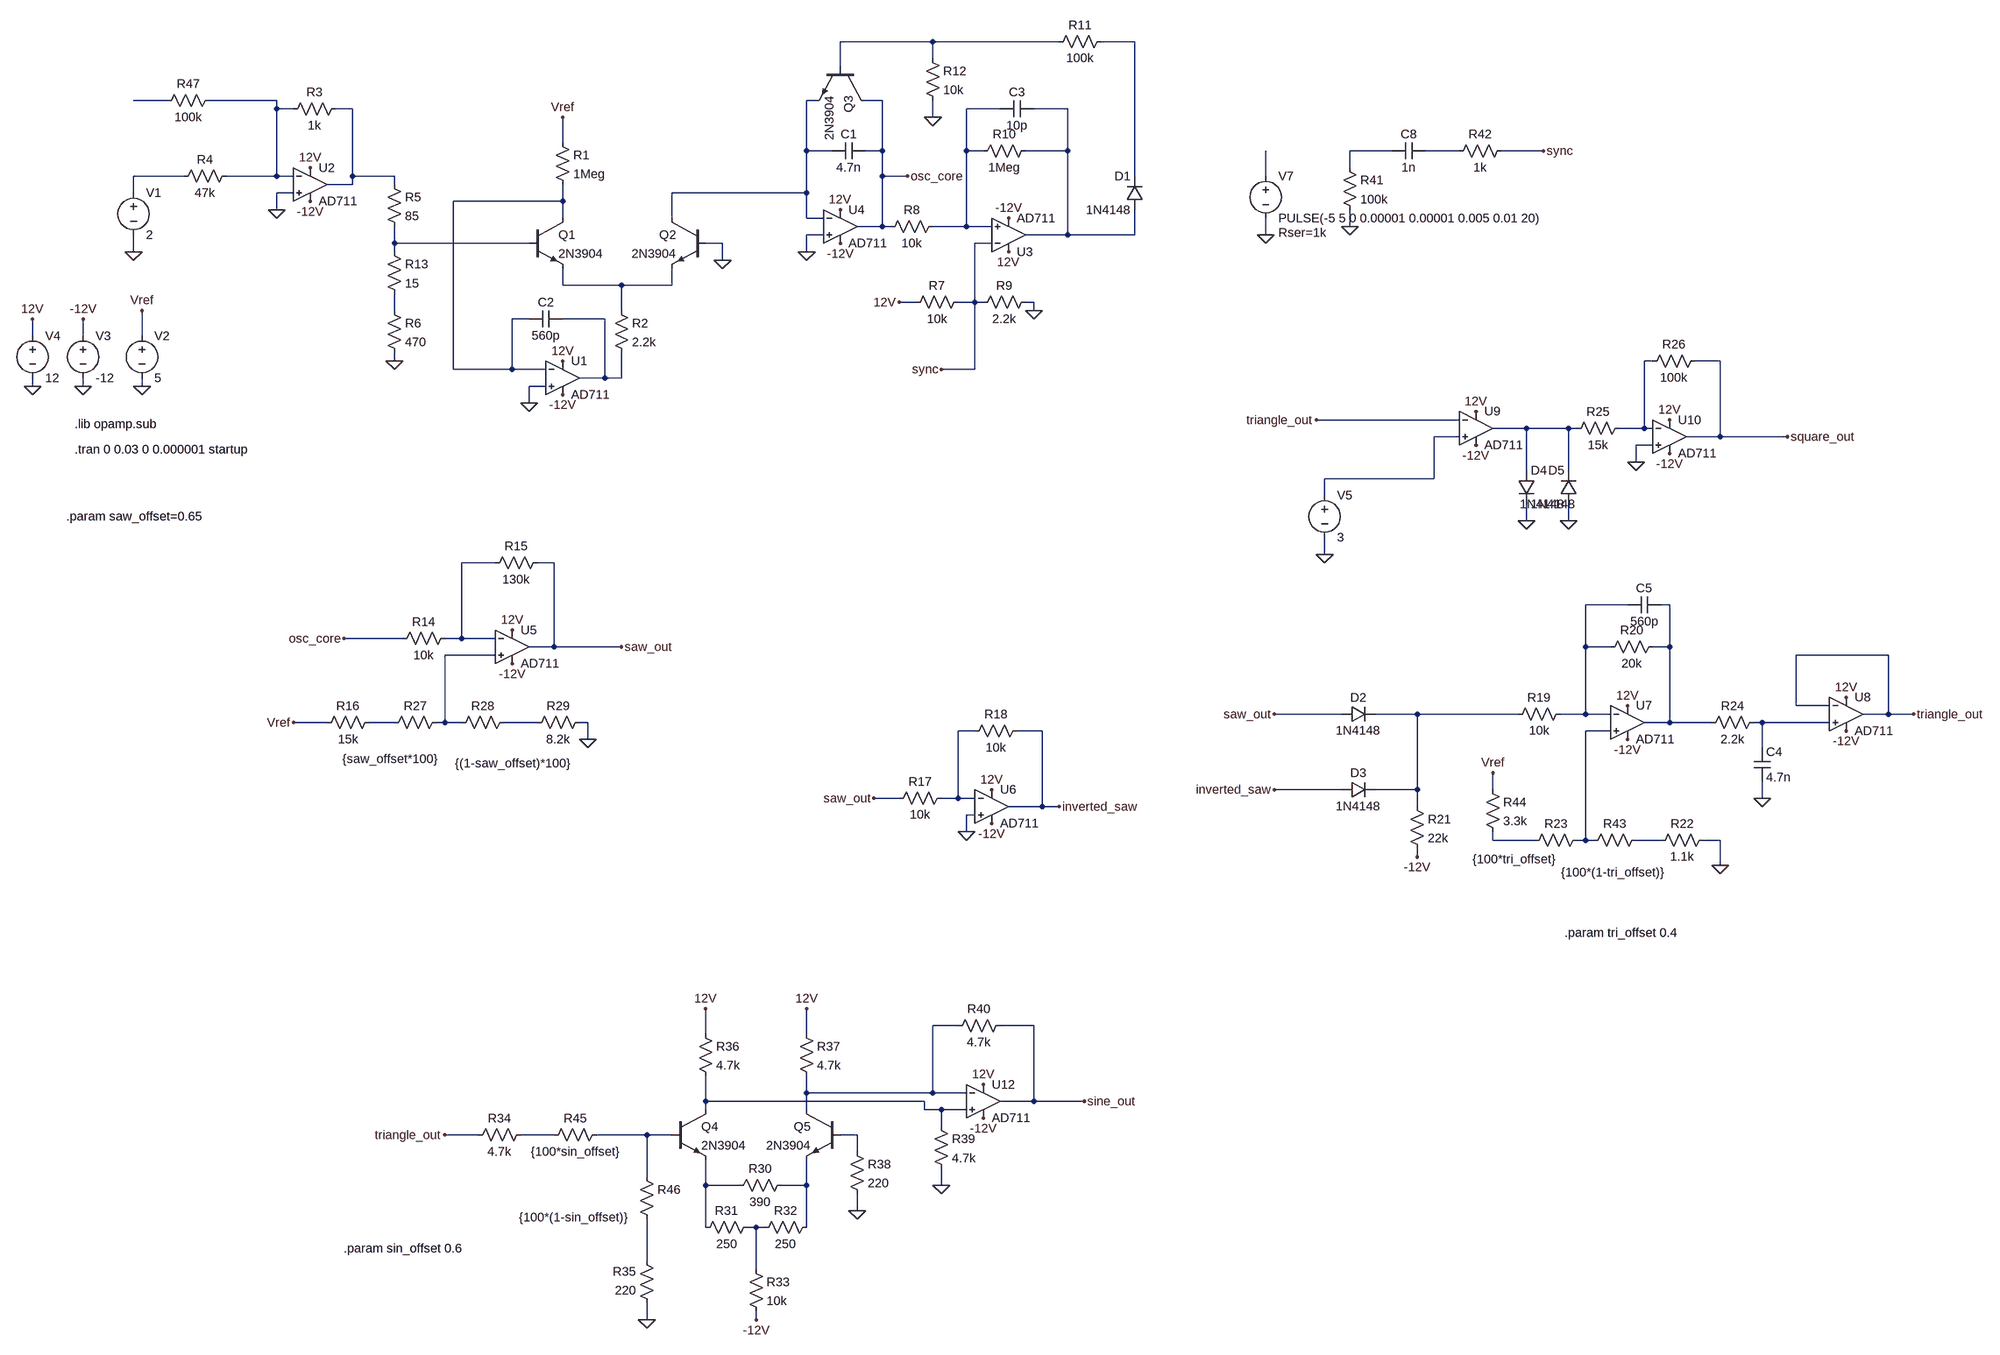
[diagram p0: schematic mfos.asc]
mfos.asc, the LTspice schematic file:
Version 4.1
SHEET 1 3204 2404
WIRE 896 -224 720 -224
WIRE 1136 -224 896 -224
WIRE 1280 -224 1216 -224
WIRE 896 -192 896 -224
WIRE 720 -176 720 -224
WIRE -560 -112 -624 -112
WIRE -352 -112 -480 -112
WIRE 672 -112 656 -112
WIRE 800 -112 768 -112
WIRE -352 -96 -352 -112
WIRE -320 -96 -352 -96
WIRE -208 -96 -240 -96
WIRE 1024 -96 960 -96
WIRE 1152 -96 1088 -96
WIRE 896 -80 896 -112
WIRE 192 -32 192 -80
WIRE 656 -16 656 -112
WIRE 704 -16 656 -16
WIRE 800 -16 800 -112
WIRE 800 -16 768 -16
WIRE 960 -16 960 -96
WIRE 992 -16 960 -16
WIRE 1152 -16 1152 -96
WIRE 1152 -16 1072 -16
WIRE 1824 -16 1744 -16
WIRE 1952 -16 1888 -16
WIRE 2112 -16 2032 -16
WIRE 1744 16 1744 -16
WIRE -528 32 -624 32
WIRE -352 32 -352 -96
WIRE -352 32 -448 32
WIRE -320 32 -352 32
WIRE -208 32 -208 -96
WIRE -128 32 -208 32
WIRE 800 32 800 -16
WIRE 848 32 800 32
WIRE 1280 32 1280 -224
WIRE 1584 32 1584 -16
WIRE -208 48 -208 32
WIRE -208 48 -256 48
WIRE -128 48 -128 32
WIRE -624 64 -624 32
WIRE -320 64 -352 64
WIRE 656 64 656 -16
WIRE 656 64 400 64
WIRE 192 80 192 48
WIRE 192 80 -16 80
WIRE -352 96 -352 64
WIRE 192 112 192 80
WIRE 400 112 400 64
WIRE 656 112 656 64
WIRE 688 112 656 112
WIRE 800 128 800 32
WIRE 800 128 752 128
WIRE 816 128 800 128
WIRE 960 128 960 -16
WIRE 960 128 896 128
WIRE 1008 128 960 128
WIRE 1744 128 1744 96
WIRE 688 144 656 144
WIRE 1152 144 1152 -16
WIRE 1152 144 1072 144
WIRE 1280 144 1280 96
WIRE 1280 144 1152 144
WIRE 1584 144 1584 112
WIRE -128 160 -128 128
WIRE 128 160 -128 160
WIRE 496 160 464 160
WIRE 1008 160 976 160
WIRE -624 176 -624 144
WIRE -128 176 -128 160
WIRE 656 176 656 144
WIRE 496 192 496 160
WIRE 192 240 192 208
WIRE 304 240 192 240
WIRE 400 240 400 208
WIRE 400 240 304 240
WIRE 864 272 832 272
WIRE 976 272 976 160
WIRE 976 272 944 272
WIRE 992 272 976 272
WIRE 1088 272 1072 272
WIRE -128 288 -128 256
WIRE 304 288 304 240
WIRE 1088 288 1088 272
WIRE 128 304 96 304
WIRE 272 304 192 304
WIRE -816 336 -816 304
WIRE -720 336 -720 304
WIRE -608 336 -608 288
WIRE -128 384 -128 368
WIRE 2320 384 2304 384
WIRE 2448 384 2400 384
WIRE -16 400 -16 80
WIRE 96 400 96 304
WIRE 96 400 -16 400
WIRE 160 400 96 400
WIRE 976 400 976 272
WIRE 976 400 912 400
WIRE 272 416 272 304
WIRE 272 416 224 416
WIRE 304 416 304 368
WIRE 304 416 272 416
WIRE -816 432 -816 416
WIRE -720 432 -720 416
WIRE -608 432 -608 416
WIRE 160 432 128 432
WIRE 128 464 128 432
WIRE 1952 496 1680 496
WIRE 2080 512 2016 512
WIRE 2160 512 2080 512
WIRE 2176 512 2160 512
WIRE 2304 512 2304 384
WIRE 2304 512 2256 512
WIRE 2320 512 2304 512
WIRE 1952 528 1904 528
WIRE 2448 528 2448 384
WIRE 2448 528 2384 528
WIRE 2576 528 2448 528
WIRE 2320 544 2288 544
WIRE 2288 576 2288 544
WIRE 2080 592 2080 512
WIRE 2160 592 2160 512
WIRE 1904 608 1904 528
WIRE 1904 608 1696 608
WIRE 1696 640 1696 608
WIRE 2080 688 2080 656
WIRE 2160 688 2160 656
WIRE 1696 752 1696 720
WIRE 64 768 0 768
WIRE 176 768 144 768
WIRE 2272 848 2192 848
WIRE 2352 848 2336 848
WIRE -112 912 -224 912
WIRE 0 912 0 768
WIRE 0 912 -32 912
WIRE 64 912 0 912
WIRE 176 928 176 768
WIRE 176 928 128 928
WIRE 304 928 176 928
WIRE 2192 928 2192 848
WIRE 2240 928 2192 928
WIRE 2352 928 2352 848
WIRE 2352 928 2320 928
WIRE 64 944 -32 944
WIRE 2768 944 2592 944
WIRE 2592 1040 2592 944
WIRE 2656 1040 2592 1040
WIRE 1728 1056 1600 1056
WIRE 1872 1056 1792 1056
WIRE 2064 1056 1872 1056
WIRE 2192 1056 2192 928
WIRE 2192 1056 2144 1056
WIRE 2240 1056 2192 1056
WIRE 2768 1056 2768 944
WIRE 2768 1056 2720 1056
WIRE 2816 1056 2768 1056
WIRE -256 1072 -320 1072
WIRE -128 1072 -176 1072
WIRE -32 1072 -32 944
WIRE -32 1072 -48 1072
WIRE 0 1072 -32 1072
WIRE 144 1072 80 1072
WIRE 240 1072 224 1072
WIRE 2352 1072 2352 928
WIRE 2352 1072 2304 1072
WIRE 2432 1072 2352 1072
WIRE 2528 1072 2512 1072
WIRE 2656 1072 2528 1072
WIRE 976 1088 944 1088
WIRE 1104 1088 1056 1088
WIRE 2240 1088 2192 1088
WIRE 240 1104 240 1072
WIRE 2528 1120 2528 1072
WIRE 1728 1200 1600 1200
WIRE 1872 1200 1872 1056
WIRE 1872 1200 1792 1200
WIRE 2016 1200 2016 1168
WIRE 832 1216 784 1216
WIRE 944 1216 944 1088
WIRE 944 1216 912 1216
WIRE 976 1216 944 1216
WIRE 2528 1216 2528 1184
WIRE 1104 1232 1104 1088
WIRE 1104 1232 1040 1232
WIRE 1136 1232 1104 1232
WIRE 1872 1232 1872 1200
WIRE 976 1248 960 1248
WIRE 960 1280 960 1248
WIRE 2016 1296 2016 1280
WIRE 2096 1296 2016 1296
WIRE 2192 1296 2192 1088
WIRE 2192 1296 2176 1296
WIRE 2208 1296 2192 1296
WIRE 2336 1296 2288 1296
WIRE 2448 1296 2416 1296
WIRE 1872 1328 1872 1312
WIRE 2448 1344 2448 1296
WIRE 944 1744 896 1744
WIRE 1088 1744 1024 1744
WIRE 464 1760 464 1712
WIRE 656 1760 656 1712
WIRE 656 1872 656 1840
WIRE 896 1872 896 1744
WIRE 896 1872 656 1872
WIRE 960 1872 896 1872
WIRE 464 1888 464 1840
WIRE 880 1888 464 1888
WIRE 1088 1888 1088 1744
WIRE 1088 1888 1024 1888
WIRE 1184 1888 1088 1888
WIRE 464 1904 464 1888
WIRE 656 1904 656 1872
WIRE 880 1904 880 1888
WIRE 912 1904 880 1904
WIRE 960 1904 912 1904
WIRE 912 1936 912 1904
WIRE 32 1952 -32 1952
WIRE 176 1952 112 1952
WIRE 352 1952 256 1952
WIRE 400 1952 352 1952
WIRE 752 1952 720 1952
WIRE 752 1984 752 1952
WIRE 352 2032 352 1952
WIRE 464 2048 464 2000
WIRE 528 2048 464 2048
WIRE 656 2048 656 2000
WIRE 656 2048 608 2048
WIRE 912 2048 912 2016
WIRE 752 2096 752 2064
WIRE 464 2128 464 2048
WIRE 560 2128 544 2128
WIRE 576 2128 560 2128
WIRE 656 2128 656 2048
WIRE 352 2192 352 2112
WIRE 560 2208 560 2128
WIRE 352 2304 352 2272
WIRE 560 2304 560 2288
FLAG 496 192 0
FLAG -608 432 0
FLAG -608 288 Vref
FLAG 192 -80 Vref
FLAG -816 432 0
FLAG -720 432 0
FLAG -816 304 12V
FLAG -720 304 -12V
FLAG 192 448 -12V
FLAG 192 384 12V
FLAG 128 464 0
FLAG -288 80 -12V
FLAG -288 16 12V
FLAG -352 96 0
FLAG -128 384 0
FLAG 656 176 0
FLAG 1088 288 0
FLAG 832 272 12V
FLAG 720 160 -12V
FLAG 720 96 12V
FLAG 896 -80 0
FLAG 1040 112 -12V
FLAG 1040 176 12V
FLAG 848 32 osc_core
FLAG -224 912 osc_core
FLAG 96 960 -12V
FLAG 96 896 12V
FLAG 304 928 saw_out
FLAG 1008 1264 -12V
FLAG 1008 1200 12V
FLAG 960 1280 0
FLAG 784 1216 saw_out
FLAG 1136 1232 inverted_saw
FLAG 1600 1056 saw_out
FLAG 1600 1200 inverted_saw
FLAG 2272 1104 -12V
FLAG 2272 1040 12V
FLAG 1872 1328 -12V
FLAG 2688 1088 -12V
FLAG 2688 1024 12V
FLAG 2816 1056 triangle_out
FLAG 1984 544 -12V
FLAG 1984 480 12V
FLAG 1696 752 0
FLAG 1680 496 triangle_out
FLAG 2352 560 -12V
FLAG 2352 496 12V
FLAG 2288 576 0
FLAG 2080 688 0
FLAG 2160 688 0
FLAG 2576 528 square_out
FLAG 352 2304 0
FLAG 464 1712 12V
FLAG 656 1712 12V
FLAG 752 2096 0
FLAG 560 2304 -12V
FLAG 992 1920 -12V
FLAG 992 1856 12V
FLAG 912 2048 0
FLAG -32 1952 triangle_out
FLAG 912 400 sync
FLAG 2112 -16 sync
FLAG 1584 144 0
FLAG 1744 128 0
FLAG 1184 1888 sine_out
FLAG 240 1104 0
FLAG -320 1072 Vref
FLAG 2448 1344 0
FLAG 2016 1168 Vref
FLAG 2528 1216 0
FLAG -624 176 0
SYMBOL npn 128 112 R0
SYMATTR InstName Q1
SYMATTR Value 2N3904
SYMBOL npn 464 112 M0
SYMATTR InstName Q2
SYMATTR Value 2N3904
SYMBOL res 176 -48 R0
SYMATTR InstName R1
SYMATTR Value 1Meg
SYMBOL voltage -608 320 R0
WINDOW 123 0 0 Left 0
WINDOW 39 0 0 Left 0
SYMATTR InstName V2
SYMATTR Value 5
SYMBOL OpAmps\\AD711 192 352 R0
SYMATTR InstName U1
SYMBOL voltage -720 320 R0
WINDOW 123 0 0 Left 0
WINDOW 39 0 0 Left 0
SYMATTR InstName V3
SYMATTR Value -12
SYMBOL voltage -816 320 R0
WINDOW 123 0 0 Left 0
WINDOW 39 0 0 Left 0
SYMATTR InstName V4
SYMATTR Value 12
SYMBOL res 288 272 R0
SYMATTR InstName R2
SYMATTR Value 2.2k
SYMBOL OpAmps\\AD711 -288 -16 R0
SYMATTR InstName U2
SYMBOL res -224 -112 R90
WINDOW 0 0 56 VBottom 2
WINDOW 3 32 56 VTop 2
SYMATTR InstName R3
SYMATTR Value 1k
SYMBOL res -432 16 R90
WINDOW 0 0 56 VBottom 2
WINDOW 3 32 56 VTop 2
SYMATTR InstName R4
SYMATTR Value 47k
SYMBOL res -144 32 R0
SYMATTR InstName R5
SYMATTR Value 85
SYMBOL res -144 272 R0
SYMATTR InstName R6
SYMATTR Value 470
SYMBOL cap 192 288 R90
WINDOW 0 0 32 VBottom 2
WINDOW 3 32 32 VTop 2
SYMATTR InstName C2
SYMATTR Value 560p
SYMBOL res 960 256 R90
WINDOW 0 0 56 VBottom 2
WINDOW 3 32 56 VTop 2
SYMATTR InstName R7
SYMATTR Value 10k
SYMBOL res 1088 256 R90
WINDOW 0 0 56 VBottom 2
WINDOW 3 32 56 VTop 2
SYMATTR InstName R9
SYMATTR Value 2.2k
SYMBOL cap 768 -32 R90
WINDOW 0 0 32 VBottom 2
WINDOW 3 32 32 VTop 2
SYMATTR InstName C1
SYMATTR Value 4.7n
SYMBOL diode 1296 96 R180
WINDOW 0 24 64 Left 2
WINDOW 3 24 0 Left 2
SYMATTR InstName D1
SYMATTR Value 1N4148
SYMBOL res 912 112 R90
WINDOW 0 0 56 VBottom 2
WINDOW 3 32 56 VTop 2
SYMATTR InstName R8
SYMATTR Value 10k
SYMBOL res 1088 -32 R90
WINDOW 0 0 56 VBottom 2
WINDOW 3 32 56 VTop 2
SYMATTR InstName R10
SYMATTR Value 1Meg
SYMBOL res 1232 -240 R90
WINDOW 0 0 56 VBottom 2
WINDOW 3 32 56 VTop 2
SYMATTR InstName R11
SYMATTR Value 100k
SYMBOL OpAmps\\AD711 720 64 R0
SYMATTR InstName U4
SYMBOL res 880 -208 R0
SYMATTR InstName R12
SYMATTR Value 10k
SYMBOL npn 768 -176 R90
SYMATTR InstName Q3
SYMATTR Value 2N3904
SYMBOL OpAmps\\AD711 1040 208 M180
SYMATTR InstName U3
SYMBOL cap 1088 -112 R90
WINDOW 0 0 32 VBottom 2
WINDOW 3 32 32 VTop 2
SYMATTR InstName C3
SYMATTR Value 10p
SYMBOL res -144 160 R0
SYMATTR InstName R13
SYMATTR Value 15
SYMBOL OpAmps\\AD711 96 864 R0
SYMATTR InstName U5
SYMBOL OpAmps\\AD711 1008 1168 R0
SYMATTR InstName U6
SYMBOL res 928 1200 R90
WINDOW 0 0 56 VBottom 2
WINDOW 3 32 56 VTop 2
SYMATTR InstName R17
SYMATTR Value 10k
SYMBOL res 1072 1072 R90
WINDOW 0 0 56 VBottom 2
WINDOW 3 32 56 VTop 2
SYMATTR InstName R18
SYMATTR Value 10k
SYMBOL diode 1728 1072 R270
WINDOW 0 32 32 VTop 2
WINDOW 3 0 32 VBottom 2
SYMATTR InstName D2
SYMATTR Value 1N4148
SYMBOL diode 1728 1216 R270
WINDOW 0 32 32 VTop 2
WINDOW 3 0 32 VBottom 2
SYMATTR InstName D3
SYMATTR Value 1N4148
SYMBOL res 2160 1040 R90
WINDOW 0 0 56 VBottom 2
WINDOW 3 32 56 VTop 2
SYMATTR InstName R19
SYMATTR Value 10k
SYMBOL OpAmps\\AD711 2272 1008 R0
SYMATTR InstName U7
SYMBOL res 2336 912 R90
WINDOW 0 0 56 VBottom 2
WINDOW 3 32 56 VTop 2
SYMATTR InstName R20
SYMATTR Value 20k
SYMBOL res 1856 1216 R0
SYMATTR InstName R21
SYMATTR Value 22k
SYMBOL cap 2336 832 R90
WINDOW 0 0 32 VBottom 2
WINDOW 3 32 32 VTop 2
SYMATTR InstName C5
SYMATTR Value 560p
SYMBOL OpAmps\\AD711 2688 992 R0
SYMATTR InstName U8
SYMBOL OpAmps\\AD711 1984 448 R0
SYMATTR InstName U9
SYMBOL voltage 1696 624 R0
WINDOW 123 0 0 Left 0
WINDOW 39 0 0 Left 0
SYMATTR InstName V5
SYMATTR Value 3
SYMBOL OpAmps\\AD711 2352 464 R0
SYMATTR InstName U10
SYMBOL res 2272 496 R90
WINDOW 0 0 56 VBottom 2
WINDOW 3 32 56 VTop 2
SYMATTR InstName R25
SYMATTR Value 15k
SYMBOL res 2416 368 R90
WINDOW 0 0 56 VBottom 2
WINDOW 3 32 56 VTop 2
SYMATTR InstName R26
SYMATTR Value 100k
SYMBOL diode 2064 592 R0
SYMATTR InstName D4
SYMATTR Value 1N4148
SYMBOL diode 2176 656 R180
WINDOW 0 24 64 Left 2
WINDOW 3 24 0 Left 2
SYMATTR InstName D5
SYMATTR Value 1N4148
SYMBOL npn 400 1904 R0
SYMATTR InstName Q4
SYMATTR Value 2N3904
SYMBOL npn 720 1904 M0
SYMATTR InstName Q5
SYMATTR Value 2N3904
SYMBOL res 624 2032 R90
WINDOW 0 0 56 VBottom 2
WINDOW 3 32 56 VTop 2
SYMATTR InstName R30
SYMATTR Value 390
SYMBOL res 560 2112 R90
WINDOW 0 0 56 VBottom 2
WINDOW 3 32 56 VTop 2
SYMATTR InstName R31
SYMATTR Value 250
SYMBOL res 672 2112 R90
WINDOW 0 0 56 VBottom 2
WINDOW 3 32 56 VTop 2
SYMATTR InstName R32
SYMATTR Value 250
SYMBOL res 544 2192 R0
SYMATTR InstName R33
SYMATTR Value 10k
SYMBOL res 128 1936 R90
WINDOW 0 0 56 VBottom 2
WINDOW 3 32 56 VTop 2
SYMATTR InstName R34
SYMATTR Value 4.7k
SYMBOL res 368 2288 R180
WINDOW 0 36 76 Left 2
WINDOW 3 36 40 Left 2
SYMATTR InstName R35
SYMATTR Value 220
SYMBOL res 448 1744 R0
SYMATTR InstName R36
SYMATTR Value 4.7k
SYMBOL res 640 1744 R0
SYMATTR InstName R37
SYMATTR Value 4.7k
SYMBOL res 736 1968 R0
SYMATTR InstName R38
SYMATTR Value 220
SYMBOL OpAmps\\AD711 992 1824 R0
SYMATTR InstName U12
SYMBOL res 896 1920 R0
SYMATTR InstName R39
SYMATTR Value 4.7k
SYMBOL res 1040 1728 R90
WINDOW 0 0 56 VBottom 2
WINDOW 3 32 56 VTop 2
SYMATTR InstName R40
SYMATTR Value 4.7k
SYMBOL voltage 1584 16 R0
WINDOW 123 0 0 Left 0
WINDOW 39 24 124 Left 2
SYMATTR SpiceLine Rser=1k
SYMATTR InstName V7
SYMATTR Value PULSE(-5 5 0 0.00001 0.00001 0.005 0.01 20)
SYMBOL res 1728 0 R0
SYMATTR InstName R41
SYMATTR Value 100k
SYMBOL cap 1888 -32 R90
WINDOW 0 0 32 VBottom 2
WINDOW 3 32 32 VTop 2
SYMATTR InstName C8
SYMATTR Value 1n
SYMBOL res 2048 -32 R90
WINDOW 0 0 56 VBottom 2
WINDOW 3 32 56 VTop 2
SYMATTR InstName R42
SYMATTR Value 1k
SYMBOL res -16 896 R90
WINDOW 0 0 56 VBottom 2
WINDOW 3 32 56 VTop 2
SYMATTR InstName R14
SYMATTR Value 10k
SYMBOL res 160 752 R90
WINDOW 0 0 56 VBottom 2
WINDOW 3 32 56 VTop 2
SYMATTR InstName R15
SYMATTR Value 130k
SYMBOL res -160 1056 R90
WINDOW 0 0 56 VBottom 2
WINDOW 3 32 56 VTop 2
SYMATTR InstName R16
SYMATTR Value 15k
SYMBOL res -32 1056 R90
WINDOW 0 0 56 VBottom 2
WINDOW 3 70 104 VTop 2
SYMATTR InstName R27
SYMATTR Value {saw_offset*100}
SYMBOL res 96 1056 R90
WINDOW 0 0 56 VBottom 2
WINDOW 3 78 -1 VTop 2
SYMATTR InstName R28
SYMATTR Value {(1-saw_offset)*100}
SYMBOL res 240 1056 R90
WINDOW 0 0 56 VBottom 2
WINDOW 3 32 56 VTop 2
SYMATTR InstName R29
SYMATTR Value 8.2k
SYMBOL res 2432 1280 R90
WINDOW 0 0 56 VBottom 2
WINDOW 3 32 56 VTop 2
SYMATTR InstName R22
SYMATTR Value 1.1k
SYMBOL res 2192 1280 R90
WINDOW 0 0 56 VBottom 2
WINDOW 3 37 135 VTop 2
SYMATTR InstName R23
SYMATTR Value {100*tri_offset}
SYMBOL res 2304 1280 R90
WINDOW 0 0 56 VBottom 2
WINDOW 3 62 60 VTop 2
SYMATTR InstName R43
SYMATTR Value {100*(1-tri_offset)}
SYMBOL res 2000 1184 R0
SYMATTR InstName R44
SYMATTR Value 3.3k
SYMBOL res 2528 1056 R90
WINDOW 0 0 56 VBottom 2
WINDOW 3 32 56 VTop 2
SYMATTR InstName R24
SYMATTR Value 2.2k
SYMBOL cap 2512 1120 R0
SYMATTR InstName C4
SYMATTR Value 4.7n
SYMBOL res 272 1936 R90
WINDOW 0 0 56 VBottom 2
WINDOW 3 32 56 VTop 2
SYMATTR InstName R45
SYMATTR Value {100*sin_offset}
SYMBOL res 336 2016 R0
WINDOW 3 -227 93 Left 2
SYMATTR InstName R46
SYMATTR Value {100*(1-sin_offset)}
SYMBOL res -464 -128 R90
WINDOW 0 0 56 VBottom 2
WINDOW 3 32 56 VTop 2
SYMATTR InstName R47
SYMATTR Value 100k
SYMBOL voltage -624 48 R0
WINDOW 123 0 0 Left 0
WINDOW 39 0 0 Left 0
SYMATTR InstName V1
SYMATTR Value 2
TEXT -736 552 Left 2 !.tran 0 0.03 0 0.000001 startup
TEXT -736 504 Left 2 !.lib opamp.sub
TEXT -752 680 Left 2 !.param saw_offset=0.65
TEXT 2152 1472 Left 2 !.param tri_offset 0.4
TEXT -224 2168 Left 2 !.param sin_offset 0.6

The netlist it stands for:
* mfos.asc
Q1 N013 N014 N015 0 2N3904
Q2 N005 0 N015 0 2N3904
R1 Vref N013 1Meg
V2 Vref 0 5
X§U1 0 N013 12V -12V N017 AD712  ; AD711, pins In+ In- V+ V- OUT
V3 -12V 0 -12
V4 12V 0 12
R2 N015 N017 2.2k
X§U2 0 N004 12V -12V N006 AD712  ; AD711, pins In+ In- V+ V- OUT
R3 N006 N004 1k
R4 N004 N011 47k
R5 N006 N014 85
R6 N016 0 470
C2 N017 N013 560p
R7 sync 12V 10k
R9 0 sync 2.2k
C1 osc_core N005 4.7n
D1 N008 N002 1N4148
R8 N007 osc_core 10k
R10 N008 N007 1Meg
R11 N002 N001 100k
X§U4 0 N005 12V -12V osc_core AD712  ; AD711, pins In+ In- V+ V- OUT
R12 N001 0 10k
Q3 osc_core N001 N005 0 2N3904
X§U3 N007 sync 12V -12V N008 AD712  ; AD711, pins In+ In- V+ V- OUT
C3 N008 N007 10p
R13 N014 N016 15
X§U5 N024 N021 12V -12V saw_out AD712  ; AD711, pins In+ In- V+ V- OUT
X§U6 0 N029 12V -12V inverted_saw AD712  ; AD711, pins In+ In- V+ V- OUT
R17 N029 saw_out 10k
R18 inverted_saw N029 10k
D2 saw_out N025 1N4148
D3 inverted_saw N025 1N4148
R19 N022 N025 10k
X§U7 N030 N022 12V -12V N023 AD712  ; AD711, pins In+ In- V+ V- OUT
R20 N023 N022 20k
R21 N025 -12V 22k
C5 N023 N022 560p
X§U8 N028 triangle_out 12V -12V triangle_out AD712  ; AD711, pins In+ In- V+ V- OUT
X§U9 N020 triangle_out 12V -12V N019 AD712  ; AD711, pins In+ In- V+ V- OUT
V5 N020 0 3
X§U10 0 N018 12V -12V square_out AD712  ; AD711, pins In+ In- V+ V- OUT
R25 N018 N019 15k
R26 square_out N018 100k
D4 N019 0 1N4148
D5 0 N019 1N4148
Q4 N034 N036 N038 0 2N3904
Q5 N033 N037 N039 0 2N3904
R30 N039 N038 390
R31 N040 N038 250
R32 N039 N040 250
R33 N040 -12V 10k
R34 N035 triangle_out 4.7k
R35 0 N041 220
R36 12V N034 4.7k
R37 12V N033 4.7k
R38 N037 0 220
X§U12 N034 N033 12V -12V sine_out AD712  ; AD711, pins In+ In- V+ V- OUT
R39 N034 0 4.7k
R40 sine_out N033 4.7k
V7 N012 0 PULSE(-5 5 0 0.00001 0.00001 0.005 0.01 20) Rser=1k
R41 N009 0 100k
C8 N010 N009 1n
R42 sync N010 1k
R14 N021 osc_core 10k
R15 saw_out N021 130k
R16 N026 Vref 15k
R27 N024 N026 {saw_offset*100}
R28 N027 N024 {(1-saw_offset)*100}
R29 0 N027 8.2k
R22 0 N032 1.1k
R23 N030 N031 {100*tri_offset}
R43 N032 N030 {100*(1-tri_offset)}
R44 Vref N031 3.3k
R24 N028 N023 2.2k
C4 N028 0 4.7n
R45 N036 N035 {100*sin_offset}
R46 N036 N041 {100*(1-sin_offset)}
R47 N004 N003 100k
V1 N011 0 2
.model D D
.lib standard.dio
.model NPN NPN
.model PNP PNP
.lib standard.bjt
.tran 0 0.03 0 0.000001 startup
.lib opamp.sub
.param saw_offset=0.65
.param tri_offset 0.4
.param sin_offset 0.6
.lib ADI1.lib
.backanno
.end